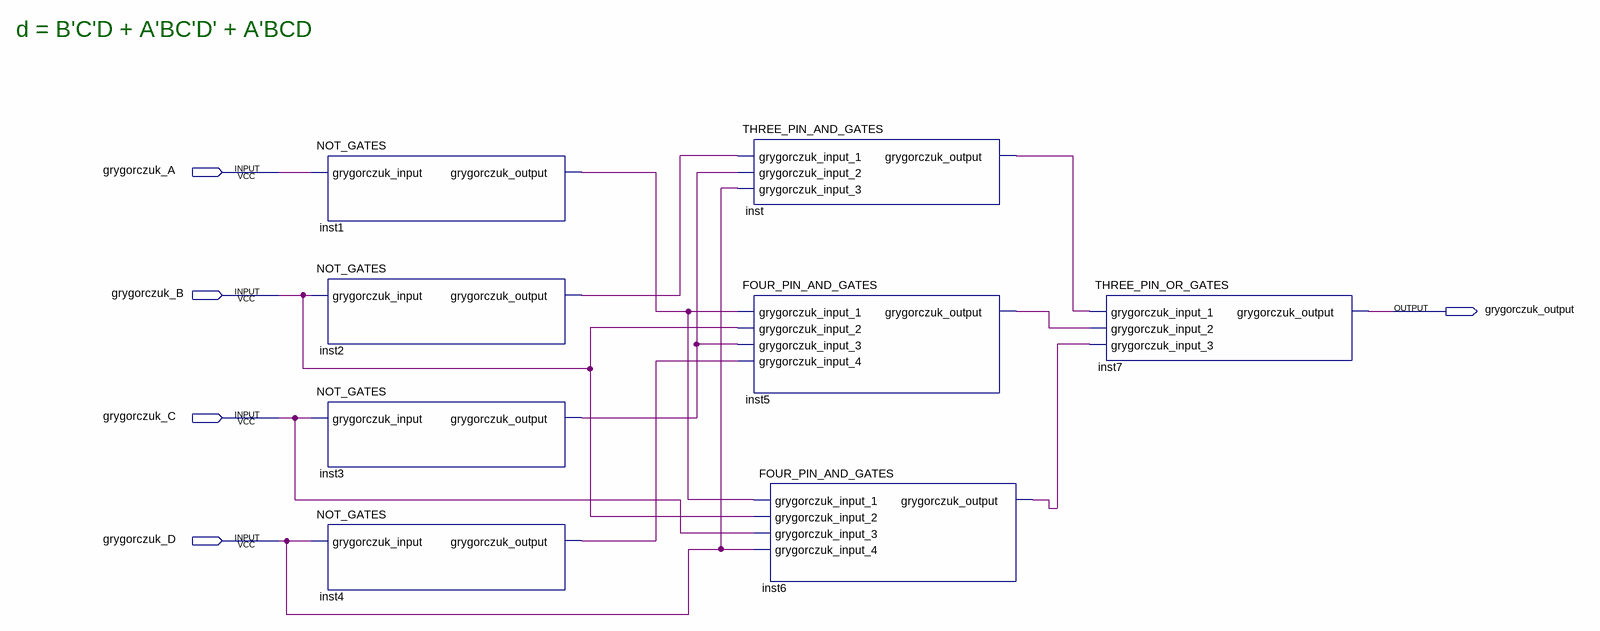
[diagram p0: schematic sheet]
// Quartus schematic SEVEN_SEGMENT_DISPLAY_NAND_D.bdf as structural Verilog: 8 symbols, 5 pins
module SEVEN_SEGMENT_DISPLAY_NAND_D (
  input  grygorczuk_A,
  input  grygorczuk_B,
  input  grygorczuk_C,
  input  grygorczuk_D,
  output grygorczuk_output
);

  wire inst1_grygorczuk_output, inst2_grygorczuk_output, inst3_grygorczuk_output, inst4_grygorczuk_output,
       inst5_grygorczuk_output, inst6_grygorczuk_output, inst_grygorczuk_output;

  NOT_GATES inst1 (.grygorczuk_input(grygorczuk_A), .grygorczuk_output(inst1_grygorczuk_output));
  NOT_GATES inst2 (.grygorczuk_input(grygorczuk_B), .grygorczuk_output(inst2_grygorczuk_output));
  NOT_GATES inst3 (.grygorczuk_input(grygorczuk_C), .grygorczuk_output(inst3_grygorczuk_output));
  NOT_GATES inst4 (.grygorczuk_input(grygorczuk_D), .grygorczuk_output(inst4_grygorczuk_output));
  THREE_PIN_AND_GATES inst (
    .grygorczuk_input_1(inst2_grygorczuk_output), .grygorczuk_input_2(inst3_grygorczuk_output),
    .grygorczuk_input_3(grygorczuk_D), .grygorczuk_output(inst_grygorczuk_output));
  FOUR_PIN_AND_GATES inst5 (
    .grygorczuk_input_1(inst1_grygorczuk_output), .grygorczuk_input_2(grygorczuk_B),
    .grygorczuk_input_3(inst3_grygorczuk_output), .grygorczuk_input_4(inst4_grygorczuk_output),
    .grygorczuk_output(inst5_grygorczuk_output));
  FOUR_PIN_AND_GATES inst6 (
    .grygorczuk_input_1(inst1_grygorczuk_output), .grygorczuk_input_2(grygorczuk_B),
    .grygorczuk_input_3(grygorczuk_C), .grygorczuk_input_4(grygorczuk_D),
    .grygorczuk_output(inst6_grygorczuk_output));
  THREE_PIN_OR_GATES inst7 (
    .grygorczuk_input_1(inst_grygorczuk_output), .grygorczuk_input_2(inst5_grygorczuk_output),
    .grygorczuk_input_3(inst6_grygorczuk_output), .grygorczuk_output(grygorczuk_output));

  // Notes on the sheet:
  //   d = B'C'D + A'BC'D' + A'BCD
endmodule
